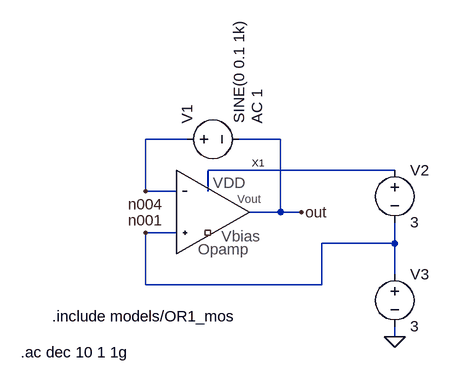
[diagram p0: schematic volfol_loop_tb.asc]
volfol_loop_tb.asc, the LTspice schematic file:
Version 4
SHEET 1 880 680
WIRE 112 32 48 32
WIRE 256 32 192 32
WIRE 432 80 144 80
WIRE 48 112 48 32
WIRE 96 112 48 112
WIRE 144 112 144 80
WIRE 256 144 256 32
WIRE 256 144 208 144
WIRE 288 144 256 144
WIRE 96 176 48 176
WIRE 432 192 432 160
WIRE 432 192 320 192
WIRE 432 240 432 192
WIRE 48 256 48 176
WIRE 320 256 320 192
WIRE 320 256 48 256
WIRE 432 336 432 320
FLAG 432 336 0
FLAG 288 144 out
FLAG 48 176 n001
FLAG 48 112 n004
SYMBOL Opamp3ureiauto 176 144 R0
SYMATTR InstName X1
SYMBOL voltage 96 32 R270
WINDOW 123 24 124 Left 2
WINDOW 39 0 0 Left 2
SYMATTR Value2 AC 1
SYMATTR InstName V1
SYMATTR Value SINE(0 0.1 1k)
SYMBOL voltage 432 64 R0
SYMATTR InstName V2
SYMATTR Value 3
SYMBOL voltage 432 224 R0
SYMATTR InstName V3
SYMATTR Value 3
TEXT -96 304 Left 2 !.include models/OR1_mos
TEXT -144 360 Left 2 !.ac dec 10 1 1g

The netlist it stands for:
* volfol_loop_tb.asc
XX1 n004 n001 out N002 NC_01 Opamp3ureiauto  ; pins Vinm Vinp Vout VDD Vbias
V1 n004 out SINE(0 0.1 1k) AC 1
V2 N002 n001 3
V3 n001 0 3
.include models/OR1_mos
.ac dec 10 1 1g
.backanno
.end